# Altium schematic sheet Sheet1.SchDoc
size A; SheetNumber: 1; SheetTotal: 1
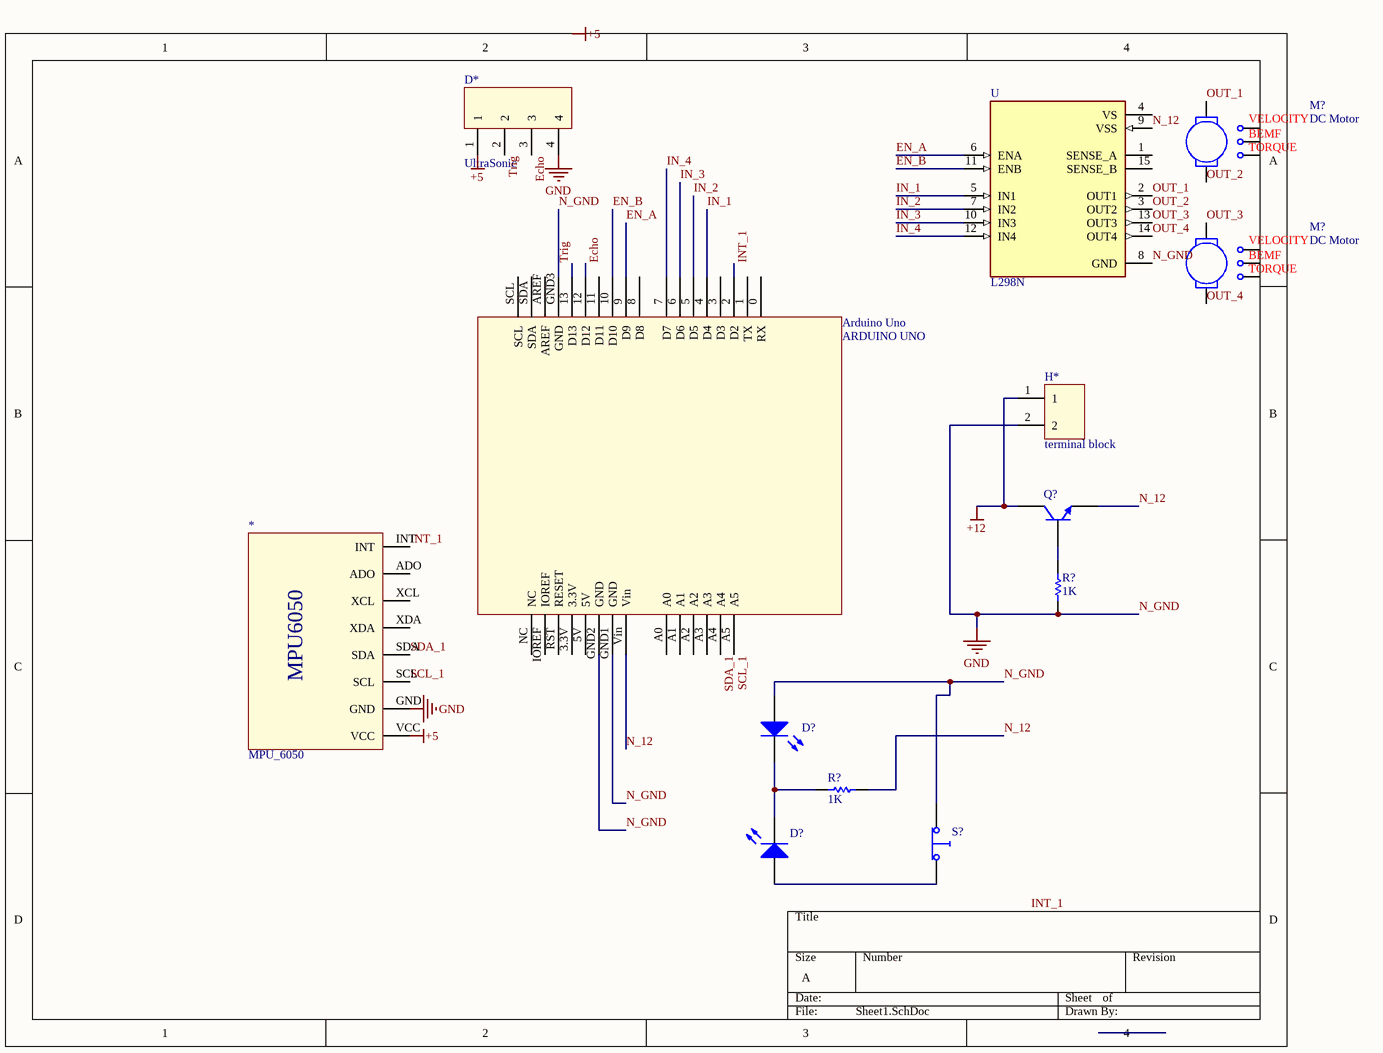
[diagram p0: Sheet1.SchDoc]

## Parts
(Parts that share a designator on the sheet are numbered #1, #2 ... from top to bottom, then left to right.)
*  MPU_6050  [MPU6050]
Arduino_Uno  ARDUINO UNO  [Arduino Uno]
D*  UltraSonic  [DATA_PIN_HEADER_4_2.54m]
D?#1  Light-Emitting Diode  (value not drawn)
D?#2  Light-Emitting Diode  (value not drawn)
H*  terminal block  [FEMALE_HEADER_2]
M?#1  DC Motor
M?#2  DC Motor
Q?  Bipolar NPN 3 Pins Transistor VBIC Model  (value not drawn)
R?#1  value 1K  (hidden comment: Resistor)
R?#2  value 1K  (hidden comment: Resistor)
S?  Push Button Normally Closed  (value not drawn)
U  L298N  [TO127P2020X500X2100-15]

## Nets
+5: *.VCC D*.1
+12: H*.1 Q?.1(C)
N_GND: *.GND Arduino_Uno.GND1(GND) Arduino_Uno.GND2(GND) Arduino_Uno.GND3(GND) D*.4 D?#1.1(A) H*.2 R?#1.1 S?.1 U.8(GND)  [also labelled GND]
Echo: Arduino_Uno.12(D12) D*.3
EN_A: Arduino_Uno.9(D9) U.6(ENA)
EN_B: Arduino_Uno.10(D10) U.11(ENB)
IN_1: Arduino_Uno.4(D4) U.5(IN1)
IN_2: Arduino_Uno.5(D5) U.7(IN2)
IN_3: Arduino_Uno.6(D6) U.10(IN3)
IN_4: Arduino_Uno.7(D7) U.12(IN4)
INT_1: *.INT Arduino_Uno.2(D2)
N_12: Arduino_Uno.Vin Q?.3(E) R?#2.2 U.9(VSS)
OUT_1: M?#1.1 U.2(OUT1)
OUT_2: M?#1.2 U.3(OUT2)
OUT_3: M?#2.1 U.13(OUT3)
OUT_4: M?#2.2 U.14(OUT4)
SCL_1: *.SCL Arduino_Uno.A5
SDA_1: *.SDA Arduino_Uno.A4
Trig: Arduino_Uno.13(D13) D*.2
NetD?#1_2: D?#1.2(K) D?#2.2(K) R?#2.1
NetD?#2_1: D?#2.1(A) S?.2
NetQ?_2: Q?.2(B) R?#1.2

Not connected (* = marked no-connect by the designer): * ADO XCL XDA; Arduino_Uno 0(RX) 1(TX) 3(D3) 3.3V 5V 8(D8) 11(D11) A0 A1 A2 A3 AREF IOREF NC RST(RESET) SCL SDA; M?#1 3 4 5; M?#2 3 4 5; U 1(SENSE_A) 4(VS) 15(SENSE_B)

## Notes on the sheet
- Labels drawn without touching a wire or pin: +5, INT_1
- (in symbol DC Motor) VELOCITY; BEMF; TORQUE
- (in symbol MPU_6050) MPU6050

## Library data of the parts
D* = DATA_PIN_HEADER_4_2.54m
D?#1 D?#2 = LED: AF: 1; BV: 0; BV_MAX: 1e99; EG: 1.11; FC: 0.5; IBV: 0.001; IS: 1e-14; MJSW: 0.33; NTUN: 30; TNOM: 27; XTI: 3; SimulationGenericComponent: True; CJO: 0; CJP: 0; CTA: 0; CTP: 0; FCS: 0.5; FV_MAX: 1e99; IKF: 0; IKR: 0; ISR: 1e-14; JSW: 0; JTUN: 0; JTUNSW: 0; KEG: 1; KF: 0; LEVEL: 1; N: 1; NBV: 1; NR: 1; NS: 1; PHP: 1; RS: 0; TCV: 0; TLEV: 0; TLEVC: 0; TM1: 0; TM2: 0; TPB: 0; TPHP: 0; TRS: 0; TRS2: 0; TT: 0; TTT1: 0; TTT2: 0; VJ: 1; XTITUN: 3
H* = FEMALE_HEADER_2
M?#1 M?#2 = DC Motor: LA: 1.5M; RA: 0.5; KE: 0.05; JM: 250U; BM: 0.1M; TL: 0; SimulationGenericComponent: True; KT: 0.05
Q? = BJT NPN VBIC: SimulationGenericComponent: True; AFN: 1; AJC: -0.5; ART: 0.1; AVC1: 0; EA: 1.12; FC: 0.9; IBBE: 1e-06; IBCI: 1e-16; IBEI: 1e-18; MC: 0.33; NCN: 2; NKF: 0.5; PC: 0.75; TNOM: 27; VERS: 1.2; XII: 3; AJE: -0.5; AJS: -0.5; AVC2: 0; BFN: 1; CBCO: 0; CBEO: 0; CCSO: 0; CJC: 0; CJCP: 0; CJE: 0; CJEP: 0; CTH: 0; DEAR: 0; EAIC: 1.12; EAIE: 1.12; EAIS: 1.12; EANC: 1.12; EANE: 1.12; EANS: 1.12; EAP: 1.12; EBBE: 0; GAMM: 0; HRCF: 1; IBCIP: 0; IBCN: 0; IBCNP: 0; IBEIP: 0; IBEN: 0; IBENP: 0; IKF: 0; IKP: 0; IKR: 0; IS: 1e-16; ISP: 0; ISRR: 1; ITF: 0; KFN: 0; ME: 0.33; MS: 0.33; NBBE: 1; NCI: 1; NCIP: 1; NCNP: 2; NEI: 1; NEN: 2; NF: 1; NFP: 1; NR: 1; PE: 0.75; PS: 0.75; QBM: 0; QCO: 0; QTF: 0; RBI: 0.1; RBP: 0.1; RBX: 0; RCI: 0.1; RCX: 0; RE: 0; RS: 0; RTH: 0; TAVC: 0; TD: 0; TF: 0; TNBBE: 0; TNF: 0; TR: 0; TVBBE1: 0; TVBBE2: 0; VBBE: 0; VEF: 0; VER: 0; VO: 0; VREF: 0; VRT: 0; VTF: 0; WBE: 1; WSP: 1; XIKF: 0; XIN: 3; XIS: 3; XISR: 0; XRBI: 0; XRBP: 0; XRBX: 0; XRCI: 0; XRCX: 0; XRE: 0; XRS: 0; XTF: 0; XVO: 0
R?#1 R?#2 = Resistor: TC1: 0; SimulationGenericComponent: True; TC2: 0
S? = Push Button NC: closed: 1; Rclosed: 1m; Ropen: 1Meg; SimulationGenericComponent: True
U = L298N: Half Bridge _4_ Driver DC Motors, Relays, Solenoids, Stepper Motors Bipolar 15-Multiwatt; MF: STMicroelectronics; MP: L298N; Package: Multiwatt-15 STMicroelectronics; Price: None; Availability: Unavailable; Value: *; SnapEDA_Link: https://www.snapeda.com/parts/L298N/STMicroelectronics/view-part/294022/?ref=snap